# EAGLE design hb-featherwing (EAGLE 8.3.1)
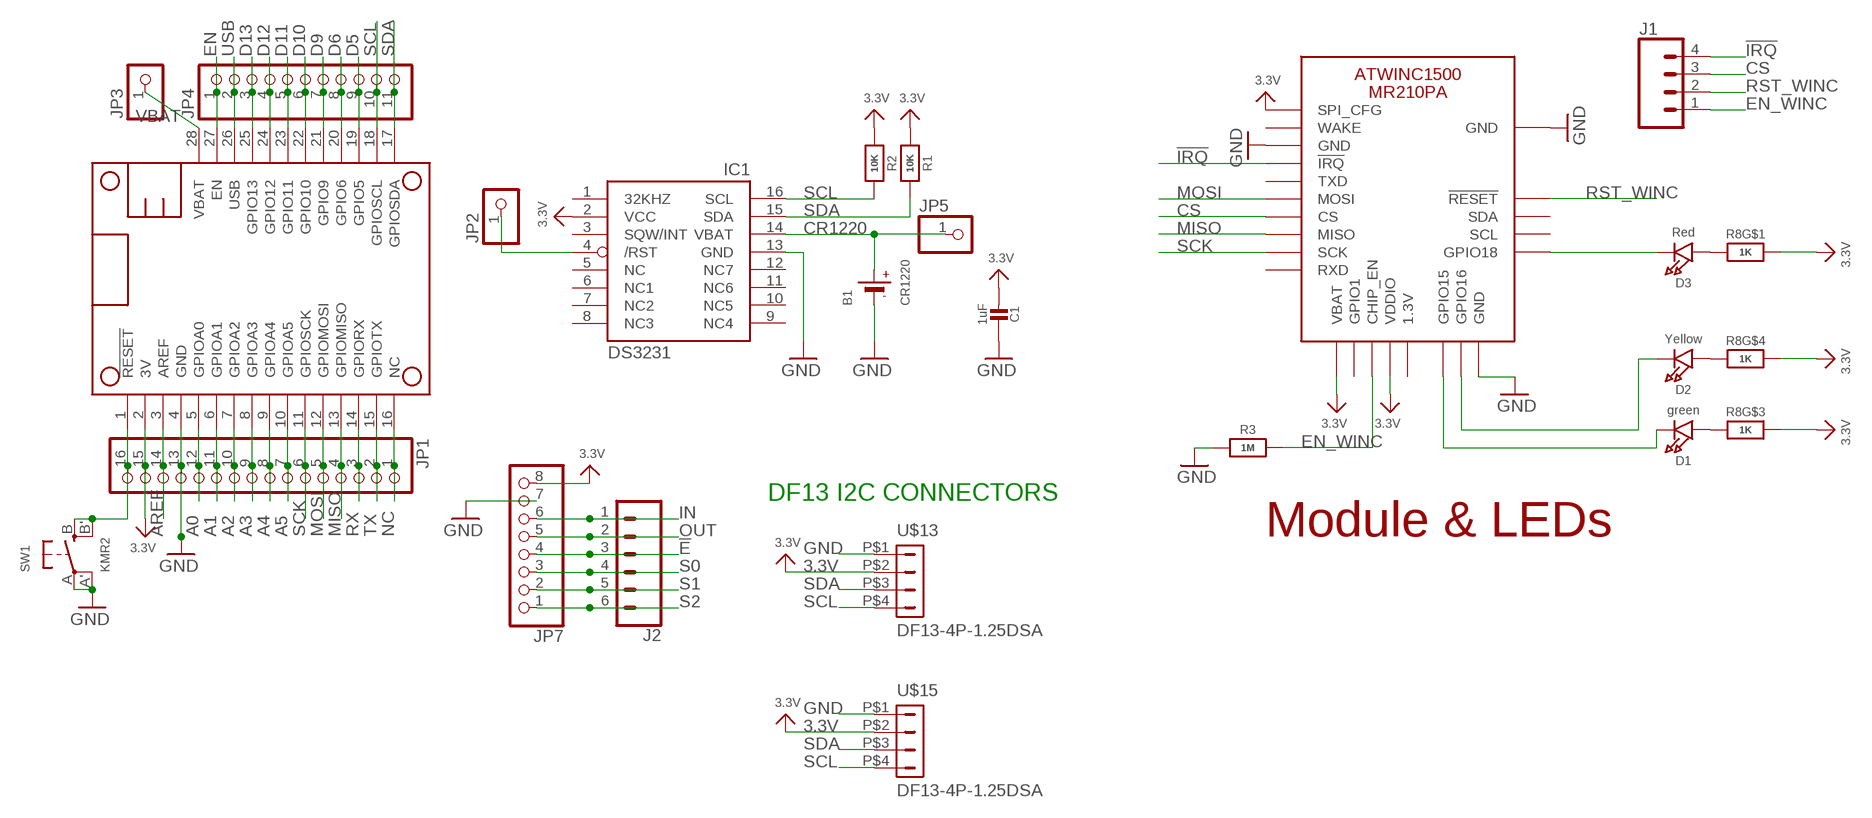
[diagram p0: schematic, sheet 1]

## Parts
B1  CR1220  BATTERYCR1220_2  [CR1220-2]
C1  1uF  CAP_CERAMIC0805-NOOUTLINE  [0805-NO]
D1  green  LED0805_NOOUTLINE  [CHIPLED_0805_NOOUTLINE]
D2  Yellow  LED0805_NOOUTLINE  [CHIPLED_0805_NOOUTLINE]
D3  Red  LED0805_NOOUTLINE  [CHIPLED_0805_NOOUTLINE]
IC1  DS3231/SO  [SO16W]
J1  CONN_04  [1X04]
J2  CONN_06SILK_FEMALE_PTH  [1X06]
JP1  HEADER-1X16ROUND  [1X16_ROUND]
JP2  HEADER-1X1ROUND  [1X01_ROUND]
JP3  HEADER-1X1ROUND  [1X01_ROUND]
JP4  HEADER-1X11  [1X11_ROUND]
JP5  HEADER-1X1ROUND  [1X01_ROUND]
JP7  PINHD-1X8BIG  [1X08-BIG]
MS1  MICROSHIELD_NODIM  [MICROSHIELD_DIM]
R1  10K  RESISTOR0805_NOOUTLINE  [0805-NO]
R2  10K  RESISTOR0805_NOOUTLINE  [0805-NO]
R3  1M  RESISTOR0805_NOOUTLINE  [0805-NO]
R8  1K  RESISTOR_4PACK  [RESPACK_4X0603]
SW1  KMR2  SWITCH_TACT_SMT4.6X2.8  [BTN_KMR2_4.6X2.8]
U$7  ATWINC1500_MR210PB  ATWINC1500_MR210PA  [ATWINC1500_MR210PA]
U$13  DF13-4P-1.25DSA  [DF13-4P-1.25DSA]
U$15  DF13-4P-1.25DSA  [DF13-4P-1.25DSA]

## Nets
3.3V: C1.2 IC1.2(VCC) JP1.15 JP7.8 MS1.2(3V) R1.1 R2.1 R8.5 R8.6 R8.8 U$7.J10(SPI_CFG) U$7.J20(VBAT) U$7.J23(VDDIO) U$13.P$2 U$15.P$2
!E: J2.3 JP7.4
!IRQ: J1.4 U$7.J13(!IRQ)
!RTC_RST: IC1.4(/RST) JP2.1
A0: JP1.12 MS1.5(GPIOA0)
A1: JP1.11 MS1.6(GPIOA1)
A2: JP1.10 MS1.7(GPIOA2)
A3: JP1.9 MS1.8(GPIOA3)
A4: JP1.8 MS1.9(GPIOA4)
A5: JP1.7 MS1.10(GPIOA5)
AREF: JP1.14 MS1.3(AREF)
CR1220: B1.+ IC1.14(VBAT) JP5.1
CS: J1.3 U$7.J16(CS)
D5: JP4.9 MS1.19(GPIO5)
D6: JP4.8 MS1.20(GPIO6)
D9: JP4.7 MS1.21(GPIO9)
D10: JP4.6 MS1.22(GPIO10)
D11: JP4.5 MS1.23(GPIO11)
D12: JP4.4 MS1.24(GPIO12)
D13: JP4.3 MS1.25(GPIO13)
EN: JP4.1 MS1.27(EN)
EN_WINC: J1.1 R3.2 U$7.J22(CHIP_EN)
GND: B1.- C1.1 IC1.13(GND) JP1.13 JP7.7 MS1.4(GND) R3.1 SW1.A'(P1) SW1.A(P) U$7.J9(GND) U$7.J12(GND) U$7.J28(GND) U$7.MTGND(GND) U$13.P$1 U$15.P$1
GPIO15: D1.C U$7.J26(GPIO15)
GPIO16: D2.C U$7.J27(GPIO16)
GPIO18: D3.C U$7.J1(GPIO18)
IN: J2.1 JP7.6
MISO: JP1.4 MS1.13(GPIOMISO) U$7.J17(MISO)
MOSI: JP1.5 MS1.12(GPIOMOSI) U$7.J15(MOSI)
N$1: D3.A R8.1
N$22: D2.A R8.4
N$24: D1.A R8.3
N$25: JP1.16 MS1.1(!RESET) SW1.B'(S1) SW1.B(S)
NC: JP1.1 MS1.16(NC)
OUT: J2.2 JP7.5
RST_WINC: J1.2 U$7.J4(!RESET)
RX: JP1.3 MS1.14(GPIORX)
S0: J2.4 JP7.3
S1: J2.5 JP7.2
S2: J2.6 JP7.1
SCK: JP1.6 MS1.11(GPIOSCK) U$7.J18(SCK)
SCL: IC1.16(SCL) JP4.10 MS1.18(GPIOSCL) R2.2 U$13.P$4 U$15.P$4
SDA: IC1.15(SDA) JP4.11 MS1.17(GPIOSDA) R1.2 U$13.P$3 U$15.P$3
TX: JP1.2 MS1.15(GPIOTX)
USB: JP4.2 MS1.26(USB)
VBAT: JP3.1 MS1.28(VBAT)
Unconnected: IC1.1(32KHZ) IC1.3(SQW/INT) IC1.5(NC) IC1.6(NC1) IC1.7(NC2) IC1.8(NC3) IC1.9(NC4) IC1.10(NC5) IC1.11(NC6) IC1.12(NC7) R8.2 R8.7 U$7.J2(SCL) U$7.J3(SDA) U$7.J11(WAKE) U$7.J14(TXD) U$7.J19(RXD) U$7.J21(GPIO1) U$7.J24(1.3V)

## Notes on the sheet
- DF13 I2C CONNECTORS
- Module & LEDs

## Library data of the parts
B1 = microbuilder:BATTERY: CR1220 SMT - Digikey: 3001K-ND CD2032 BAT-HLD-001 - Digikey: BAT-HLD-001-ND
C1 = microbuilder:CAP_CERAMIC: Ceramic Capacitors For new designs, use the packages preceded by an '_' character since they are more reliable: The following footprints should be used on most boards: _0402 - Standard footprint for regular board layouts _0603 - Standard footprint for regular board layouts _0805 - Standard footprint for regular board layouts _1206 - Standard footprint for regular board layouts For extremely tight-pitch boards where space is at a premium, the following 'micro-pitch' footprints can be used (smaller pads, no silkscreen outline, etc.): _0402MP - Micro-pitch footprint for very dense/compact boards _0603MP - Micro-pitch footprint for very dense/compact boards _0805MP - Micro-pitch footprint for very dense/compact boards _1206MP - Micro-pitch footprint for very dense/compact boards
D1-D3 = microbuilder:LED: LED 0603 - 0603 Surface Mount Package 2mA: Green LED - Low Power (3.9mcd, 2ma, 1.7Vf) - Digikey: 475-2709-2-ND Orange LED - Low Power (9.8mcd, 2ma, 1.8Vf) - Digikey: 475-1194-2-ND Red LED - Low Power (5mcd, 2ma, 1.8Vf) - Digikey: 475-1195-2-ND Yellow LED - Low Power (7mcd, 2ma, 1.8Vf) - Digikey: 475-1196-2-ND 5mA: Blue LED - Low Power (17mcd, 5ma, 2.9Vf) - Digikey: LNJ937W8CRACT-ND 0805 - 0805 Surface Mount Package 2mA: Red LED (8.8mcd, 2mA, 1.8Vf, Clear) - Low Power [Digikey: 475-2510-1-ND] Green LED (5mcd, 2mA, 1.8Vf, Clear) - Low Power [Digikey: 475-2730-1-ND] Yellow LED (11.3mcd, 2mA, 1.8Vf, Clear) - Low Power [Digikey: 475-2555-1-ND] 20mA: Red LED (104mcd, 20mA, Diffused) - LS R976 [Digikey: 475-1278-6-ND] Red LED (12mcd, 20mA, 2.0Vf, Clear) - APT2012EC [Digikey: 754-1128-1-ND] Green LED (15mcd, 20mA, 2.2Vf, Clear) - APT2012GC [Digikey: 754-1131-1-ND] Orange LED (160mcd, 20mA, 2.1Vf, Clear) - APT2012SECK [Digikey: 754-1130-1-ND] 1206 - 1206 Surface Mount Package Green LED (26mcd, 20mA, Diffused) - LG N971 [Digikey: 475-1407-6-ND] Red LED (15mcd, 20mA, Diffused) - LH N974 [Digikey: 475-1416-6-ND] Cree - Cree High-Power Surface Mount LEDs XPEBWT-L1-0000-00D50 - White 111lm 350mA 2.9Vf 6200K 110° XTEAWT-00-0000-00000LEE3 - White 114lm 350mA 2.85Vf 5000K 115° Everlight - Everlight 45-21 Series Surface Mount LEDs 45-21/QK2C-B2832AC2CB2/2T - Warm White 2000mcd 20mA 3.25Vf 3050K 120° 45-21/LK2C-B38452C4CB2/2T - Nuetral White 2000mcd 20mA 3.25Vf 4150K 120° 45-21/LK2C-B50634C6CB2/2T - Cold White 2200mcd 20mA 3.25Vf 5650K 120° PLCC2 Reverse Mount LS T77K-J1L2-1-0-2-R18-Z - Red 11.25mcd 2mA 1.8Vf 630nm 120° LO T77K-L1M2-24-Z - Orange 19.6mcd 2mA 1.8Vf 606nm 120° LY T77K-K2M1-26-Z - Yellow 15.7mcd 2mA 1.8Vf 587nm 120°
IC1 = adafruit:DS3231
J1 = SparkFun-Connectors:CONN_04: Multi connection point. Often used as Generic Header-pin footprint for 0.1 inch spaced/style header connections On any of the 0.1 inch spaced packages, you can populate with these: Break Away Headers - Straight <https://www.sparkfun.com/products/116> (PRT-00116) Break Away Male Headers - Right Angle <https://www.sparkfun.com/products/553> (PRT-00553) Female Headers <https://www.sparkfun.com/products/115> (PRT-00115) Break Away Headers - Machine Pin <https://www.sparkfun.com/products/117> (PRT-00117) Break Away Female Headers - Swiss Machine Pin <https://www.sparkfun.com/products/743> (PRT-00743) For SCREWTERMINALS and SPRING TERMINALS visit here: Screw Terimnals on SparkFun.com <https://www.sparkfun.com/search/results?term=Screw+Terminals> (5mm/3.5mm/2.54mm spacing) This device is also useful as a general connection point to wire up your design to another part of your project. Our various solder wires solder well into these plated through hole pads. Hook-Up Wire - Assortment (Stranded, 22 AWG) <https://www.sparkfun.com/products/11375> (PRT-11375) Hook-Up Wire - Assortment (Solid Core, 22 AWG) <https://www.sparkfun.com/products/11367> (PRT-11367) View the entire wire category on our website here <https://www.sparkfun.com/categories/141> Special notes: Molex polarized connector foot print use with SKU : PRT-08231 with associated crimp pins and housings. 1MM SMD Version SKU: PRT-10208; PROD_ID: CONN-09696
J2 = SparkFun-Connectors:CONN_06: Multi connection point. Often used as Generic Header-pin footprint for 0.1 inch spaced/style header connections On any of the 0.1 inch spaced packages, you can populate with these: Break Away Headers - Straight <https://www.sparkfun.com/products/116> (PRT-00116) Break Away Male Headers - Right Angle <https://www.sparkfun.com/products/553> (PRT-00553) Female Headers <https://www.sparkfun.com/products/115> (PRT-00115) Break Away Headers - Machine Pin <https://www.sparkfun.com/products/117> (PRT-00117) Break Away Female Headers - Swiss Machine Pin <https://www.sparkfun.com/products/743> (PRT-00743) Arduino Stackable Header - 6 Pin <https://www.sparkfun.com/products/9280> (PRT-09280) For SCREWTERMINALS and SPRING TERMINALS visit here: Screw Terimnals on SparkFun.com <https://www.sparkfun.com/search/results?term=Screw+Terminals> (5mm/3.5mm/2.54mm spacing) This device is also useful as a general connection point to wire up your design to another part of your project. Our various solder wires solder well into these plated through hole pads. Hook-Up Wire - Assortment (Stranded, 22 AWG) <https://www.sparkfun.com/products/11375> (PRT-11375) Hook-Up Wire - Assortment (Solid Core, 22 AWG) <https://www.sparkfun.com/products/11367> (PRT-11367) View the entire wire category on our website here <https://www.sparkfun.com/categories/141>; PROD_ID: CONN-08437
JP1 = microbuilder:HEADER-1X16: PIN HEADER
JP2 JP3 JP5 = microbuilder:HEADER-1X1: PIN HEADER
JP4 = microbuilder:HEADER-1X11
JP7 = adafruit:PINHD-1X8: PIN HEADER
MS1 = microbuilder:MICROSHIELD
R1-R3 = microbuilder:RESISTOR: Resistors For new designs, use the packages preceded by an '_' character since they are more reliable: The following footprints should be used on most boards: _0402 - Standard footprint for regular board layouts _0603 - Standard footprint for regular board layouts _0805 - Standard footprint for regular board layouts _1206 - Standard footprint for regular board layouts For extremely tight-pitch boards where space is at a premium, the following 'micro-pitch' footprints can be used (smaller pads, no silkscreen outline, etc.): _0402MP - Micro-pitch footprint for very dense/compact boards _0603MP - Micro-pitch footprint for very dense/compact boards _0805MP - Micro-pitch footprint for very dense/compact boards _1206MP - Micro-pitch footprint for very dense/compact boards
R8 = microbuilder:RESISTOR_4PACK: Resistor Packs (4 resistors) 4 x 0603 10K 1/16W - Digikey: YC164J-10KCT-ND
SW1 = microbuilder:SWITCH_TACT_SMT: SMT Tact Switches 6x6mm - Digikey: P12940SCT-ND KMR2 (4.6x2.8mm) - Digikey: 401-1426-1-ND EVQ-PQHB55 - Light Touch, 160GF (4.5x4.5mm) - Digikey: P8090SCT-ND KMT0 - KMT021 NGJ LHS (etc.) IP68/Waterproof - Digikey: CKN10289CT-ND
U$7 = microbuilder:ATWINC1500_MR210PA: ATWINC1500_MR210PA wifi module
U$13 U$15 = con-hirose-df13:DF13-4P-1.25: DF13-4P 1.25mm Pitch Miniature Crimping Connector.

## Board
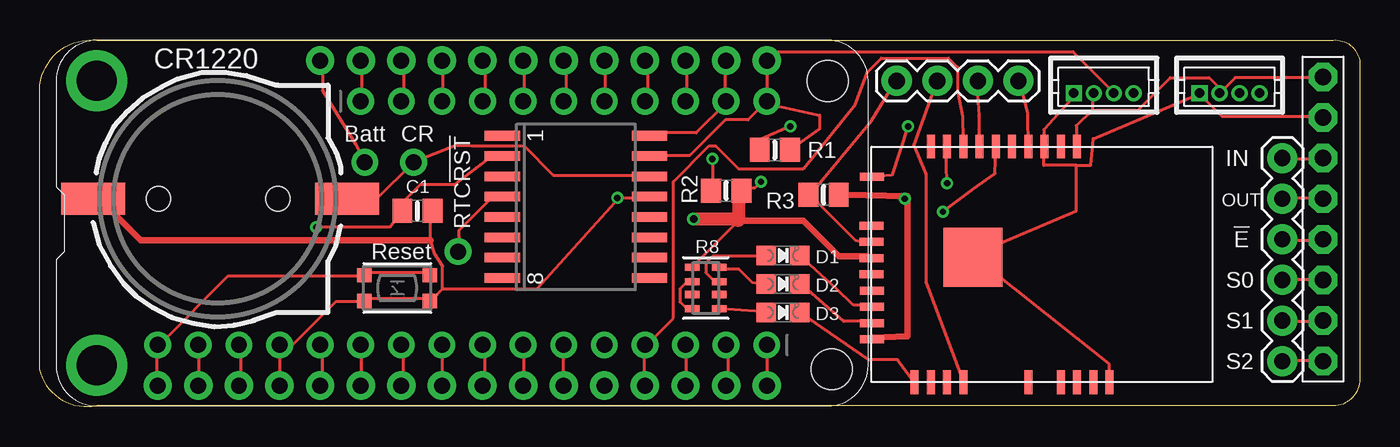
[diagram p1: board, top side]
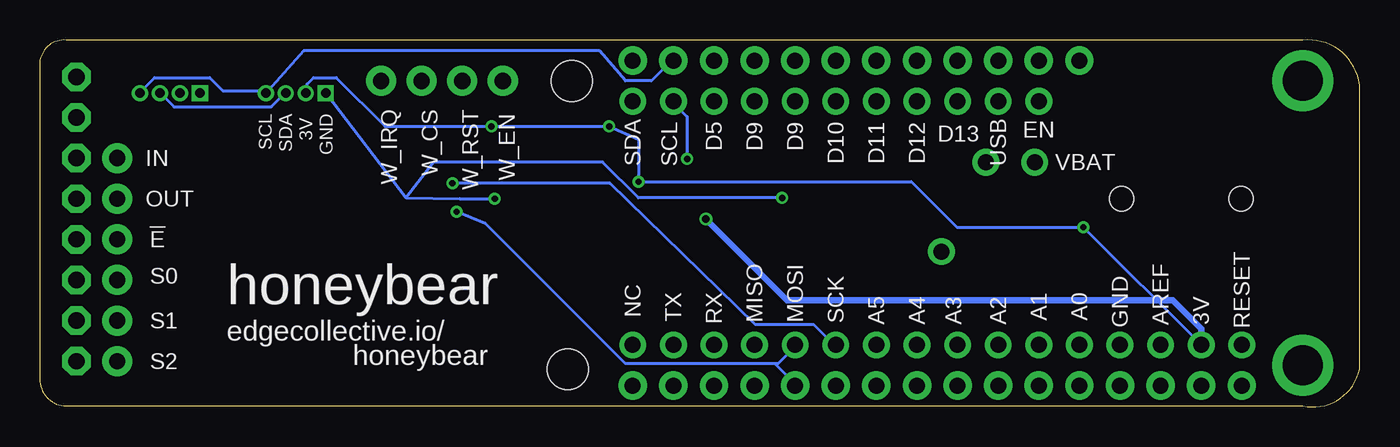
[diagram p2: board, bottom side, seen from below]

Size 82.55 x 22.95 mm. Coordinates in mm from the lower left corner, seen from the top.
Outline: 80.77,0.07 3.56,0.07 arc-90 0,2.35 0,20.13 arc-90 3.56,22.93 80.77,22.93 arc-90 82.55,21.66 82.55,1.59 arc-90 80.77,0.07
Copper layers (1*16): Top 0.0356mm / dielectric 1.5011mm / Bottom 0.0356mm
Design rules "LaenPCBOrder": minimum track width 6mil, minimum drill 13mil, track to track 6mil, track to pad 6mil, pad to pad 6mil, via to via 6mil, smd to smd 6mil, copper to edge 15mil, drill to drill 6mil, minimum pad ring 7mil, minimum via ring 7mil, stop-mask expansion 3mil, vias tented up to drill 0mil, thermal gap 10mil

### Footprints (pad centres in the part's own frame; a part is rotated, then mirrored left to right if it is on the bottom)
CR1220-2 = smd 4 x 2: + 8.29,0; - -7.6,0 | hole 1.5: 3.95,0; -3.5,0
0805-NO = smd 1.24 x 1.5: 1 -0.95,0; 2 0.95,0
CHIPLED_0805_NOOUTLINE = smd 1.2 x 1.2: A 0,-1.05; C 0,1.05
SO16W = smd 0.6 x 2.2: 1 -4.445,-4.6; 2 -3.175,-4.6; 3 -1.905,-4.6; 4 -0.635,-4.6; 5 0.635,-4.6; 6 1.905,-4.6; 7 3.175,-4.6; 8 4.445,-4.6; 9 4.445,4.6; 10 3.175,4.6; 11 1.905,4.6; 12 0.635,4.6; 13 -0.635,4.6; 14 -1.905,4.6; 15 -3.175,4.6; 16 -4.445,4.6
1X04 = drill 1.016 pad 1.88: 1 0,0; 2 2.54,0; 3 5.08,0; 4 7.62,0
1X06 = drill 1.016 pad 1.88: 1 0,0; 2 2.54,0; 3 5.08,0; 4 7.62,0; 5 10.16,0; 6 12.7,0
1X16_ROUND = drill 1 pad 1.676: 1 -19.05,0; 2 -16.51,0; 3 -13.97,0; 4 -11.43,0; 5 -8.89,0; 6 -6.35,0; 7 -3.81,0; 8 -1.27,0; 9 1.27,0; 10 3.81,0; 11 6.35,0; 12 8.89,0; 13 11.43,0; 14 13.97,0; 15 16.51,0; 16 19.05,0
1X01_ROUND = drill 1 pad 1.676: 1 0,0
1X11_ROUND = drill 1 pad 1.676: 1 -12.7,0; 2 -10.16,0; 3 -7.62,0; 4 -5.08,0; 5 -2.54,0; 6 0,0; 7 2.54,0; 8 5.08,0; 9 7.62,0; 10 10.16,0; 11 12.7,0
1X08-BIG = drill 1.016 pad 1.778 octagon: 1 -8.89,0; 2 -6.35,0; 3 -3.81,0; 4 -1.27,0; 5 1.27,0; 6 3.81,0; 7 6.35,0; 8 8.89,0
MICROSHIELD_DIM = drill 1 pad 1.778: 1 6.35,1.27; 2 8.89,1.27; 3 11.43,1.27; 4 13.97,1.27; 5 16.51,1.27; 6 19.05,1.27; 7 21.59,1.27; 8 24.13,1.27; 9 26.67,1.27; 10 29.21,1.27; 11 31.75,1.27; 12 34.29,1.27; 13 36.83,1.27; 14 39.37,1.27; 15 41.91,1.27; 16 44.45,1.27; 17 44.45,21.59; 18 41.91,21.59; 19 39.37,21.59; 20 36.83,21.59; 21 34.29,21.59; 22 31.75,21.59; 23 29.21,21.59; 24 26.67,21.59; 25 24.13,21.59; 26 21.59,21.59; 27 19.05,21.59; 28 16.51,21.59 | drill 2.5 pad 3.81: P$1 2.54,20.32; P$2 2.54,2.54 | hole 2.54: 48.26,20.32; 48.514,2.286
RESPACK_4X0603 = smd 0.45 x 0.9: 1 -1.3,-0.85; 2 -0.4,-0.85; 3 0.4,-0.85; 4 1.3,-0.85; 5 1.3,0.85; 6 0.4,0.85; 7 -0.4,0.85; 8 -1.3,0.85
BTN_KMR2_4.6X2.8 = smd 0.9 x 0.9: A 2.05,0.8; A' -2.05,0.8; B 2.05,-0.8; B' -2.05,-0.8
ATWINC1500_MR210PA = smd 1.5 x 0.5: J1 7.146,-4.973; J2 7.146,-3.957; J3 7.146,-2.941; J4 7.146,-1.925; J5 7.146,2.139; J6 7.146,4.171; J7 7.146,5.187; J8 7.146,6.203; J9 7.146,7.219; J10 -7.584,5.181; J11 -7.584,4.165; J12 -7.584,3.149; J13 -7.584,2.133; J14 -7.584,1.117; J15 -7.584,0.101; J16 -7.584,-0.915; J17 -7.584,-1.931; J18 -7.584,-2.947; J19 -7.584,-3.963 | smd 0.5 x 1.5: J20 -5.684,-7.643; J21 -2.636,-7.663; J22 -1.62,-7.663; J23 -0.604,-7.663; J24 0.412,-7.663; J25 1.428,-7.643; J26 2.444,-7.643; J27 3.46,-7.643; J28 4.476,-7.643 | smd 3.7 x 3.7: MTGND -0.666,-1.331
DF13-4P-1.25DSA = drill 0.6 pad 1.016 square: P$1 1.875,0 | drill 0.6 pad 1.016: P$2 0.625,0; P$3 -0.625,0; P$4 -1.875,0

### Placement (x,y rotation side)
B1  10.92,13.02 0 top
C1  23.62,12.26 180 top
D1  46.48,9.46 270 top
D2  46.48,7.69 270 top
D3  46.48,5.91 270 top
IC1  33.53,12.51 270 top
J1  53.59,20.39 0 top
J2  77.72,15.56 270 top
JP1  26.42,3.88 180 top
JP2  26.16,9.72 0 top
JP3  20.32,15.31 0 top
JP4  32.77,19.12 0 top
JP5  23.37,15.31 0 top
JP7  80.26,11.75 90 top
MS1  1.02,0.07 0 top
R1  45.97,16.07 0 top
R2  42.93,13.53 180 top
R3  49.02,13.27 180 top
R8  41.66,7.43 90 top
SW1  22.35,7.43 180 top
U$7  59.69,8.7 270 top
U$13  66.55,19.62 180 top
U$15  74.42,19.62 180 top

### Tracks (layer width: path | path; a pad name or v marks a point on that pad's centre or on a via)
3.3V  (via drill 0.39, 0.45)
  Top 0.203: JP1.15 9.96,3.72 9.96,1.49 MS1.2 | IC1.2 28.85,15.51 28.04,15.51 25.91,13.88 23.77,13.88 22.71,12.82 22.96,12.61 22.61,12.26 22.66,12.26 | v17.27,11.24 21.9,11.24 22.66,12.26 | 22.66,12.26 C1.2 | R8.8 40.64,6.16 40.44,6.16 40.03,6.57 40.03,7.38 40.64,7.99 R8.6 40.84,7.99 40.84,8.6 R8.5 40.84,8.8 43.69,11.65 | 43.69,13.48 R2.1 43.89,13.68 44.7,13.68 v45.11,14.09 | 51.77,9.41 U$7.J23 | JP7.8 80.26,20.59 74.78,20.59 73.97,19.78 U$15.P$2 73.76,19.78 73.76,19.98 73.15,20.59 70.71,20.59 68.68,18.56 65.84,18.56 | v46.94,17.54 45.11,16.73 45.11,16.12 R1.1 | v54.3,17.54 53.29,14.49 U$7.J20 | 65.84,18.56 64.82,17.59 U$7.J10 | 65.84,18.56 65.84,19.57 U$13.P$2
  Top 0.406: 51.77,9.41 49.99,9.41 47.75,11.65 43.69,11.65
  Top 0.813: 43.69,13.48 43.69,11.65 43.59,11.75 v40.89,11.75
  Bottom 0.203: JP1.15 v17.27,11.24 25.2,11.24 28.04,14.09 v45.11,14.09 45.11,16.73 v46.94,17.54 v54.3,17.54 60.96,17.54 64.01,20.59 65.43,20.59 65.84,20.18 65.84,19.78 U$13.P$2
  Bottom 0.406: v40.89,11.75 35.81,6.67 11.68,6.67 9.91,4.89 JP1.15
!E
  Top 0.203: JP7.4 80.26,10.43 77.83,10.43 J2.3
!IRQ
  Top 0.203: U$7.J13 61.77,17.59 61.77,18.35 61.27,20.39 J1.4
!RTC_RST
  Top 0.203: IC1.4 28.85,13.07 28.24,13.07 26.21,11.04 26.21,10.63 JP2.1
A0
  Top 0.203: JP1.12 17.68,3.72 17.68,1.49 MS1.5
A1
  Top 0.203: JP1.11 20.12,3.72 20.12,1.49 MS1.6
A2
  Top 0.203: JP1.10 22.76,3.72 22.76,1.49 MS1.7
A3
  Top 0.203: JP1.9 25.2,3.72 25.2,1.49 MS1.8
A4
  Top 0.203: JP1.8 27.84,3.72 27.84,1.49 MS1.9
A5
  Top 0.203: JP1.7 30.28,3.72 30.28,1.49 MS1.10
AREF
  Top 0.203: JP1.14 12.6,3.72 12.6,1.49 MS1.3
CR1220
  Top 0.203: IC1.14 38,14.49 32.11,14.49 30.28,16.32 27.03,16.32 26.06,16.37 JP5.1 23.57,15.41 23.22,15.15 21.13,13.07 19.3,13.07 B1.+
CS
  Top 0.203: U$7.J16 58.73,17.34 58.73,18.2 58.57,20.39 J1.3
D5
  Top 0.203: JP4.9 40.44,19.17 40.44,21.61 MS1.19
D6
  Top 0.203: JP4.8 38,19.17 38,21.61 MS1.20
D9
  Top 0.203: JP4.7 35.36,19.17 35.36,21.61 MS1.21
D10
  Top 0.203: JP4.6 32.92,19.17 32.92,21.61 MS1.22
D11
  Top 0.203: JP4.5 30.28,19.17 30.28,21.61 MS1.23
D12
  Top 0.203: JP4.4 27.84,19.17 27.84,21.61 MS1.24
D13
  Top 0.203: JP4.3 25.2,19.17 25.2,21.61 MS1.25
EN
  Top 0.203: JP4.1 20.12,19.17 20.12,21.61 MS1.27
EN_WINC
  Top 0.203: 48.16,13.27 51,10.43 52.02,10.18 U$7.J22 | 48.16,13.27 52.02,17.9 53.54,20.39 J1.1 | 48.16,13.27 R3.2
GND  (via drill 0.39)
  Top 0.203: JP7.7 80.26,18.15 73.97,18.15 72.75,19.37 72.75,19.57 U$15.P$1 72.54,19.57 65.89,16.78 65.73,15.1 64.82,15.1 | 52.12,4.33 51.97,4.33 U$7.J28 | U$13.P$1 64.82,19.57 62.79,17.34 U$7.J12 62.79,15.1 64.82,15.1 | 58.22,9.46 58.98,8.96 66.85,2.71 U$7.J9 | 58.22,9.46 58.78,9.21 U$7.MTGND 58.22,9.46 | 64.82,15.1 64.82,12.26 58.22,9.46 | MS1.4 15.04,1.49 15.04,3.72 JP1.13 15.04,3.93 15.85,3.93 18.49,6.57 20.12,6.57 SW1.A 20.32,6.77 24.38,6.77 SW1.A' 24.59,6.77 25.2,7.38 | 25.2,7.38 25.2,8.8 24.69,9.57 24.44,10.43 24.44,12.26 C1.1 | 25.2,7.38 31.09,7.38 36.02,12.82 v36.12,13.07 38,13.07 IC1.13 | 3.86,12.87 3.45,12.87 B1.-
  Top 0.406: 52.12,4.33 54.25,4.44 54.25,13.17 | 54.25,13.17 50.34,13.27 R3.1 | v54.1,13.02 54.25,13.17 | 3.86,12.87 6.3,10.43 24.44,10.43
  Bottom 0.203: v54.1,13.02 56.29,13.02 59.64,13.07 | 59.64,13.07 64.62,19.57 U$13.P$1 | 59.64,13.07 57.91,15.31 47.35,15.31 45.11,13.07 v36.12,13.07
GPIO15
  Top 0.203: D1.C 49.84,7.38 50.9,6.37 52.27,6.37 U$7.J26
GPIO16
  Top 0.203: D2.C 48.06,7.33 50.29,5.35 51.77,5.35 U$7.J27
GPIO18
  Top 0.203: D3.C 51.87,2.96 52.02,2.96 53.64,2.96 U$7.J1
IN
  Top 0.203: JP7.6 80.26,15.51 77.83,15.51 J2.1
MISO
  Top 0.203: U$7.J17 57.71,17.85 57.71,18.2 57.4,19.78 57.4,21.25 56.84,21.81 52.63,21.81 51.77,20.95 51,18.91 47.75,14.9 43.69,14.9 42.27,16.32 41.86,16.32 39.62,14.09 39.62,5.55 38,3.93 JP1.4 37.8,3.72 37.8,1.49 MS1.13
MOSI  (via drill 0.39)
  Top 0.203: v56.49,12.21 58.47,13.68 59.74,14.6 U$7.J15
  Bottom 0.203: v56.49,12.21 54.66,11.45 45.92,2.71 36.58,2.71 | 36.58,2.71 36.37,2.71 35.36,3.72 JP1.5 | 36.58,2.71 35.36,1.49 MS1.12
N$1
  Top 0.203: R8.1 45.21,5.96 45.31,5.96 D3.A
N$22
  Top 0.203: R8.4 42.67,8.6 43.74,8.6 44.55,7.79 D2.A
N$24
  Top 0.203: R8.3 42.47,7.99 42.06,7.99 41.66,8.4 41.66,9.01 42.06,9.41 45.31,9.41 D1.A
N$25
  Top 0.203: SW1.B' 24.38,8.4 20.32,8.4 SW1.B 20.12,8.19 11.79,8.19 7.52,3.93 JP1.16 7.32,3.72 7.32,1.49 MS1.1
NC
  Top 0.203: JP1.1 45.52,3.72 45.52,1.49 MS1.16
OUT
  Top 0.203: JP7.5 80.26,13.07 77.83,13.07 J2.2
RST_WINC
  Top 0.203: U$7.J4 55.42,7.79 55.42,14.54 54.66,16.32 J1.2
RX
  Top 0.203: JP1.3 40.44,3.72 40.44,1.49 MS1.14
S0
  Top 0.203: JP7.3 80.26,7.99 77.83,7.99 J2.4
S1
  Top 0.203: JP7.2 80.26,5.35 77.83,5.35 J2.5
S2
  Top 0.203: JP7.1 80.26,2.91 77.83,2.91 J2.6
SCK  (via drill 0.39)
  Top 0.203: v56.74,13.99 56.69,15.2 56.69,15.87 U$7.J18 | MS1.11 32.72,1.49 32.72,3.72 JP1.6
  Bottom 0.203: v56.74,13.99 46.89,13.99 37.8,5.15 34.14,5.15 32.92,3.93 JP1.6
SCL  (via drill 0.39)
  Top 0.203: v42.06,15.51 42.06,13.68 R2.2 | IC1.16 38.2,17.14 41.05,17.14 42.88,18.96 JP4.10 42.88,19.17 42.88,21.61 MS1.18
  Bottom 0.203: U$15.P$4 76.2,19.78 75.39,20.59 71.93,20.59 71.12,19.78 68.48,19.78 U$13.P$4 68.28,19.78 66.04,22.27 47.55,22.27 45.92,20.39 44.3,20.39 43.08,21.61 MS1.18 | v42.06,15.51 42.06,18.15 42.88,18.96 JP4.10
SDA
  Top 0.203: R1.2 48.77,17.39 48.77,18.25 45.52,18.96 JP4.11 | JP4.11 44.3,17.95 42.88,17.95 40.64,15.71 38.2,15.71 IC1.15 | JP4.11 45.52,19.17 45.52,21.61 MS1.17 45.52,21.81 45.92,22.22 64.62,22.22 67.06,19.78 U$13.P$3
  Bottom 0.203: U$13.P$3 67.26,19.57 68.07,18.76 74.17,18.76 74.98,19.57 U$15.P$3
TX
  Top 0.203: JP1.2 43.08,3.72 43.08,1.49 MS1.15
USB
  Top 0.203: JP4.2 22.76,19.17 22.76,21.61 MS1.26
VBAT
  Top 0.203: JP3.1 20.02,15.87 19.76,16.42 17.68,19.78 17.68,21.61 MS1.28

### Text on the board
tPlace: CR1220 | Batt | CR | RTC!RST | Reset
tNames: 1 | IN | R2 | OUT | !E | 8 | S0 | S1 | S2
bNames: W_RST | W_CS | W_IRQ | EN | D12 | D11 | D10 | D9 | D9 | D5 | SCL | W_EN | GND | 3V | SDA | SCL | D13 | VBAT | USB | SDA | IN | OUT | RESET | !E | AREF | MOSI | MISO | GND | SCK | NC | S0 | 3V | A0 | A1 | A2 | A3 | A4 | A5 | RX | TX | honeybear | S1 | edgecollective.io/ | honeybear | S2